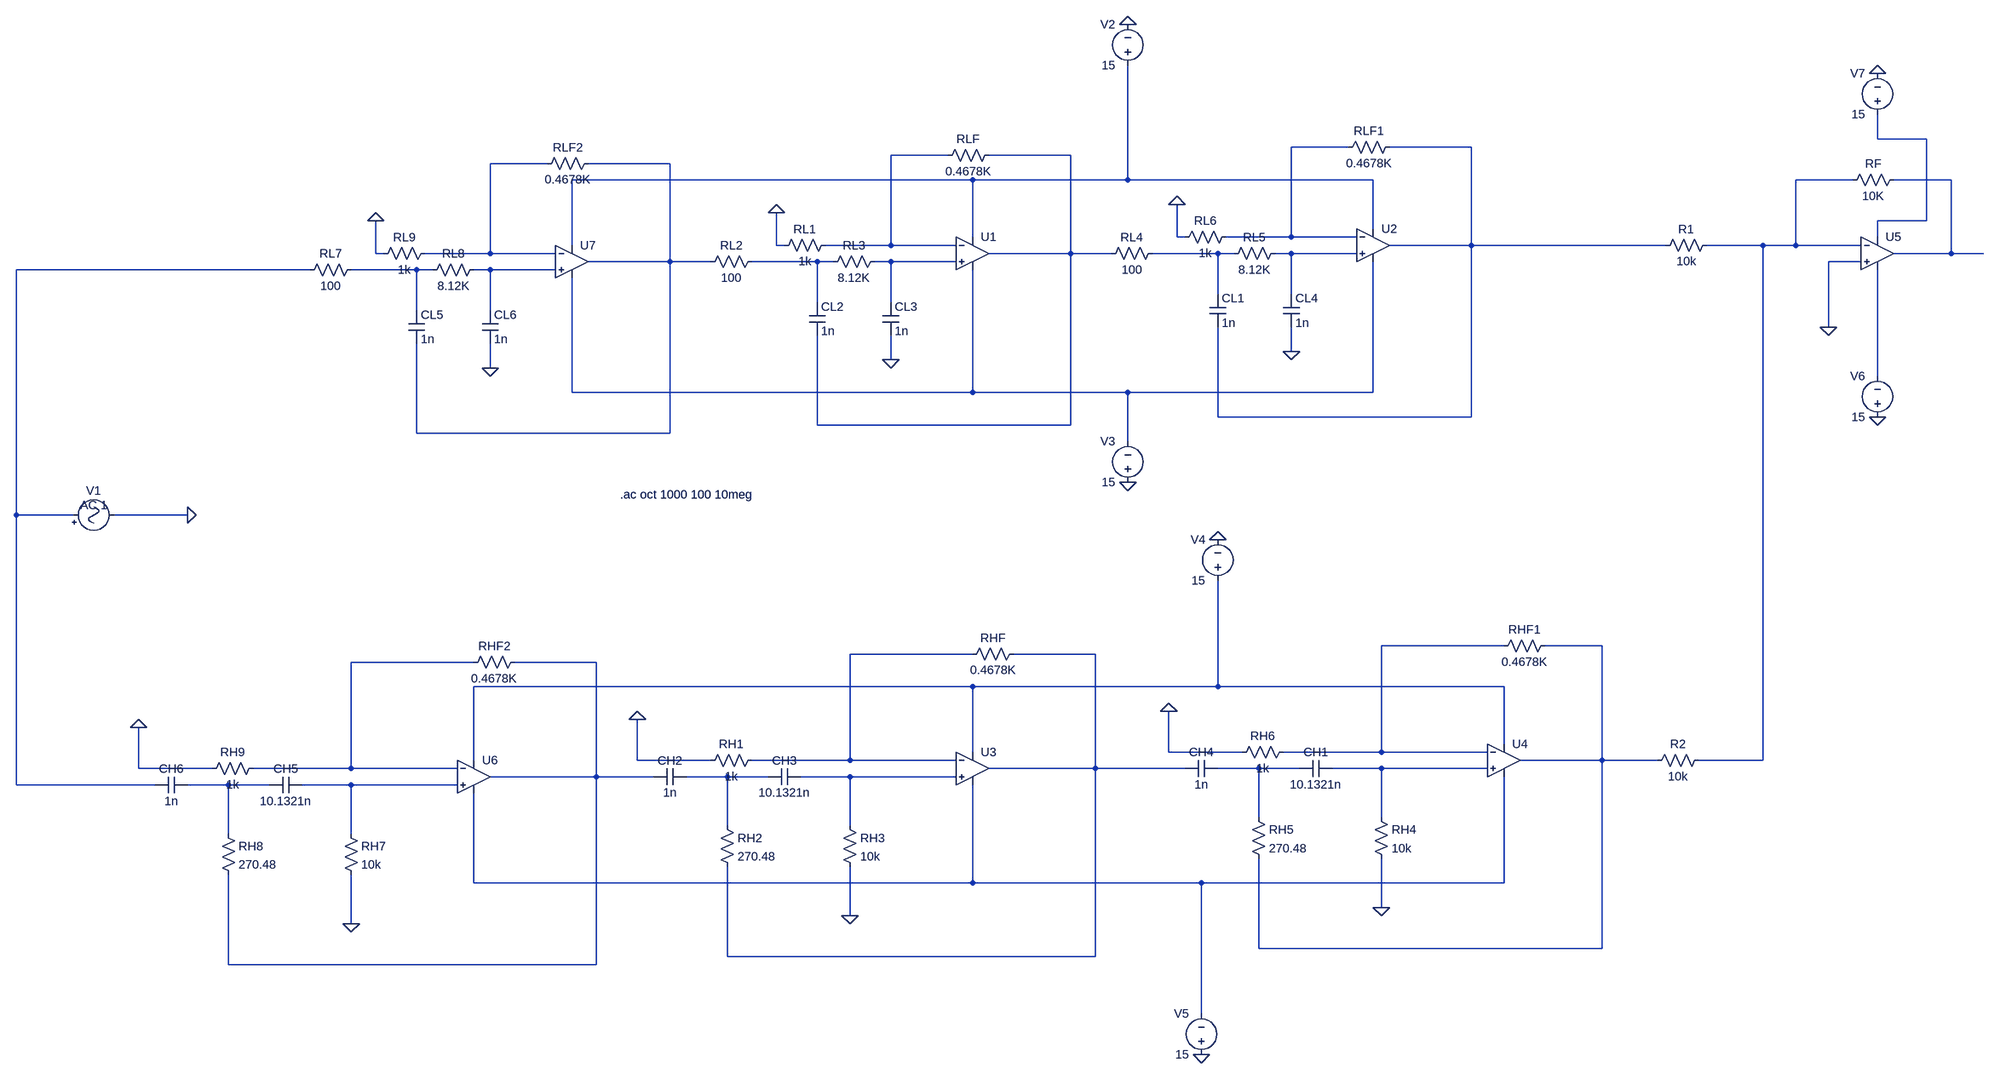
[diagram p0: schematic Band reject filter-schematic.asc]
Band reject filter-schematic.asc, the LTspice schematic file:
Version 4
SHEET 1 880 680
WIRE -1584 -2080 -1584 -2128
WIRE -1488 -2080 -1584 -2080
WIRE -2784 -2064 -2896 -2064
WIRE -2544 -2064 -2704 -2064
WIRE -3568 -2048 -3680 -2048
WIRE -3328 -2048 -3488 -2048
WIRE -4352 -2032 -4464 -2032
WIRE -4112 -2032 -4272 -2032
WIRE -3520 -2000 -4304 -2000
WIRE -3216 -2000 -3216 -2224
WIRE -3216 -2000 -3520 -2000
WIRE -2736 -2000 -3216 -2000
WIRE -1632 -2000 -1744 -2000
WIRE -1440 -2000 -1552 -2000
WIRE -1488 -1920 -1488 -2080
WIRE -1488 -1920 -1584 -1920
WIRE -2736 -1904 -2736 -2000
WIRE -3520 -1888 -3520 -2000
WIRE -3120 -1888 -3120 -1952
WIRE -3104 -1888 -3120 -1888
WIRE -2896 -1888 -2896 -2064
WIRE -2896 -1888 -3024 -1888
WIRE -2768 -1888 -2896 -1888
WIRE -1584 -1888 -1584 -1920
WIRE -4304 -1872 -4304 -2000
WIRE -3904 -1872 -3904 -1936
WIRE -3888 -1872 -3904 -1872
WIRE -3680 -1872 -3680 -2048
WIRE -3680 -1872 -3808 -1872
WIRE -3552 -1872 -3680 -1872
WIRE -2544 -1872 -2544 -2064
WIRE -2544 -1872 -2704 -1872
WIRE -2048 -1872 -2544 -1872
WIRE -1808 -1872 -1968 -1872
WIRE -1744 -1872 -1744 -2000
WIRE -1744 -1872 -1808 -1872
WIRE -1616 -1872 -1744 -1872
WIRE -4688 -1856 -4688 -1920
WIRE -4672 -1856 -4688 -1856
WIRE -4464 -1856 -4464 -2032
WIRE -4464 -1856 -4592 -1856
WIRE -4336 -1856 -4464 -1856
WIRE -3328 -1856 -3328 -2048
WIRE -3328 -1856 -3488 -1856
WIRE -3248 -1856 -3328 -1856
WIRE -3040 -1856 -3168 -1856
WIRE -3008 -1856 -3040 -1856
WIRE -2896 -1856 -2928 -1856
WIRE -2768 -1856 -2896 -1856
WIRE -1440 -1856 -1440 -2000
WIRE -1440 -1856 -1552 -1856
WIRE -1376 -1856 -1440 -1856
WIRE -4112 -1840 -4112 -2032
WIRE -4112 -1840 -4272 -1840
WIRE -4032 -1840 -4112 -1840
WIRE -3824 -1840 -3952 -1840
WIRE -3792 -1840 -3824 -1840
WIRE -3680 -1840 -3712 -1840
WIRE -3552 -1840 -3680 -1840
WIRE -1616 -1840 -1680 -1840
WIRE -4816 -1824 -5408 -1824
WIRE -4608 -1824 -4736 -1824
WIRE -4576 -1824 -4608 -1824
WIRE -4464 -1824 -4496 -1824
WIRE -4336 -1824 -4464 -1824
WIRE -3040 -1776 -3040 -1856
WIRE -2896 -1776 -2896 -1856
WIRE -3824 -1760 -3824 -1840
WIRE -3680 -1760 -3680 -1840
WIRE -4608 -1744 -4608 -1824
WIRE -4464 -1744 -4464 -1824
WIRE -1680 -1712 -1680 -1840
WIRE -2896 -1664 -2896 -1712
WIRE -3680 -1648 -3680 -1696
WIRE -4464 -1632 -4464 -1680
WIRE -1584 -1616 -1584 -1824
WIRE -4304 -1584 -4304 -1808
WIRE -3520 -1584 -3520 -1824
WIRE -3520 -1584 -4304 -1584
WIRE -3216 -1584 -3520 -1584
WIRE -2736 -1584 -2736 -1840
WIRE -2736 -1584 -3216 -1584
WIRE -3040 -1536 -3040 -1712
WIRE -2544 -1536 -2544 -1872
WIRE -2544 -1536 -3040 -1536
WIRE -3824 -1520 -3824 -1696
WIRE -3328 -1520 -3328 -1856
WIRE -3328 -1520 -3824 -1520
WIRE -4608 -1504 -4608 -1680
WIRE -4112 -1504 -4112 -1840
WIRE -4112 -1504 -4608 -1504
WIRE -3216 -1488 -3216 -1584
WIRE -5408 -1344 -5408 -1824
WIRE -5280 -1344 -5408 -1344
WIRE -5056 -1344 -5200 -1344
WIRE -2480 -1088 -2720 -1088
WIRE -2240 -1088 -2400 -1088
WIRE -3520 -1072 -3760 -1072
WIRE -3280 -1072 -3440 -1072
WIRE -4496 -1056 -4736 -1056
WIRE -4256 -1056 -4416 -1056
WIRE -3520 -1008 -4496 -1008
WIRE -3040 -1008 -3040 -1216
WIRE -3040 -1008 -3520 -1008
WIRE -2480 -1008 -3040 -1008
WIRE -2480 -896 -2480 -1008
WIRE -3520 -880 -3520 -1008
WIRE -3136 -880 -3136 -960
WIRE -2992 -880 -3136 -880
WIRE -2720 -880 -2720 -1088
WIRE -2720 -880 -2912 -880
WIRE -2512 -880 -2720 -880
WIRE -4496 -864 -4496 -1008
WIRE -4176 -864 -4176 -944
WIRE -4032 -864 -4176 -864
WIRE -3760 -864 -3760 -1072
WIRE -3760 -864 -3952 -864
WIRE -3552 -864 -3760 -864
WIRE -2240 -864 -2240 -1088
WIRE -2240 -864 -2448 -864
WIRE -2064 -864 -2240 -864
WIRE -1808 -864 -1808 -1872
WIRE -1808 -864 -1984 -864
WIRE -5152 -848 -5152 -928
WIRE -5008 -848 -5152 -848
WIRE -4736 -848 -4736 -1056
WIRE -4736 -848 -4928 -848
WIRE -4528 -848 -4736 -848
WIRE -3280 -848 -3280 -1072
WIRE -3280 -848 -3488 -848
WIRE -3104 -848 -3280 -848
WIRE -2960 -848 -3040 -848
WIRE -2880 -848 -2960 -848
WIRE -2720 -848 -2816 -848
WIRE -2512 -848 -2720 -848
WIRE -4256 -832 -4256 -1056
WIRE -4256 -832 -4464 -832
WIRE -4144 -832 -4256 -832
WIRE -4000 -832 -4080 -832
WIRE -3920 -832 -4000 -832
WIRE -3760 -832 -3856 -832
WIRE -3552 -832 -3760 -832
WIRE -5408 -816 -5408 -1344
WIRE -5120 -816 -5408 -816
WIRE -4976 -816 -5056 -816
WIRE -4896 -816 -4976 -816
WIRE -4736 -816 -4832 -816
WIRE -4528 -816 -4736 -816
WIRE -2960 -752 -2960 -848
WIRE -2720 -752 -2720 -848
WIRE -4000 -736 -4000 -832
WIRE -3760 -736 -3760 -832
WIRE -4976 -720 -4976 -816
WIRE -4736 -720 -4736 -816
WIRE -4496 -624 -4496 -800
WIRE -3520 -624 -3520 -816
WIRE -3520 -624 -4496 -624
WIRE -3072 -624 -3520 -624
WIRE -2480 -624 -2480 -832
WIRE -2480 -624 -3072 -624
WIRE -2720 -576 -2720 -672
WIRE -3760 -560 -3760 -656
WIRE -4736 -544 -4736 -640
WIRE -2960 -496 -2960 -672
WIRE -2240 -496 -2240 -864
WIRE -2240 -496 -2960 -496
WIRE -4000 -480 -4000 -656
WIRE -3280 -480 -3280 -848
WIRE -3280 -480 -4000 -480
WIRE -4976 -464 -4976 -640
WIRE -4256 -464 -4256 -832
WIRE -4256 -464 -4976 -464
WIRE -3072 -368 -3072 -624
FLAG -3904 -1936 0
FLAG -3680 -1648 0
FLAG -3120 -1952 0
FLAG -2896 -1664 0
FLAG -3216 -2304 0
FLAG -3216 -1408 0
FLAG -3760 -560 0
FLAG -4176 -944 0
FLAG -2720 -576 0
FLAG -3136 -960 0
FLAG -3040 -1296 0
FLAG -3072 -288 0
FLAG -1680 -1712 0
FLAG -1584 -1536 0
FLAG -1584 -2208 0
FLAG -4736 -544 0
FLAG -5152 -928 0
FLAG -4688 -1920 0
FLAG -4464 -1632 0
FLAG -5056 -1344 0
SYMBOL OpAmps\\UniversalOpAmp2 -3520 -1856 R0
SYMATTR InstName U1
SYMATTR Value2 Avol=1Meg GBW=100G Slew=10Meg
SYMBOL cap -3840 -1760 R0
SYMATTR InstName CL2
SYMATTR Value 1n
SYMBOL cap -3696 -1760 R0
SYMATTR InstName CL3
SYMATTR Value 1n
SYMBOL res -3936 -1856 R90
WINDOW 0 0 56 VBottom 2
WINDOW 3 32 56 VTop 2
SYMATTR InstName RL2
SYMATTR Value 100
SYMBOL res -3696 -1856 R90
WINDOW 0 0 56 VBottom 2
WINDOW 3 32 56 VTop 2
SYMATTR InstName RL3
SYMATTR Value 8.12K
SYMBOL res -3792 -1888 R90
WINDOW 0 0 56 VBottom 2
WINDOW 3 32 56 VTop 2
SYMATTR InstName RL1
SYMATTR Value 1k
SYMBOL res -3472 -2064 R90
WINDOW 0 0 56 VBottom 2
WINDOW 3 32 56 VTop 2
SYMATTR InstName RLF
SYMATTR Value 0.4678K
SYMBOL OpAmps\\UniversalOpAmp2 -2736 -1872 R0
SYMATTR InstName U2
SYMATTR Value2 Avol=1Meg GBW=100G Slew=10Meg
SYMBOL cap -3056 -1776 R0
SYMATTR InstName CL1
SYMATTR Value 1n
SYMBOL cap -2912 -1776 R0
SYMATTR InstName CL4
SYMATTR Value 1n
SYMBOL res -3152 -1872 R90
WINDOW 0 0 56 VBottom 2
WINDOW 3 32 56 VTop 2
SYMATTR InstName RL4
SYMATTR Value 100
SYMBOL res -2912 -1872 R90
WINDOW 0 0 56 VBottom 2
WINDOW 3 32 56 VTop 2
SYMATTR InstName RL5
SYMATTR Value 8.12K
SYMBOL res -3008 -1904 R90
WINDOW 0 0 56 VBottom 2
WINDOW 3 32 56 VTop 2
SYMATTR InstName RL6
SYMATTR Value 1k
SYMBOL res -2688 -2080 R90
WINDOW 0 0 56 VBottom 2
WINDOW 3 32 56 VTop 2
SYMATTR InstName RLF1
SYMATTR Value 0.4678K
SYMBOL voltage -3216 -2208 R180
WINDOW 0 24 96 Left 2
WINDOW 3 24 16 Left 2
WINDOW 123 0 0 Left 0
WINDOW 39 0 0 Left 0
SYMATTR InstName V2
SYMATTR Value 15
SYMBOL voltage -3216 -1392 R180
WINDOW 0 24 96 Left 2
WINDOW 3 24 16 Left 2
WINDOW 123 0 0 Left 0
WINDOW 39 0 0 Left 0
SYMATTR InstName V3
SYMATTR Value 15
SYMBOL OpAmps\\UniversalOpAmp2 -3520 -848 R0
SYMATTR InstName U3
SYMATTR Value2 Avol=1Meg GBW=100G Slew=10Meg
SYMBOL res -3424 -1088 R90
WINDOW 0 0 56 VBottom 2
WINDOW 3 32 56 VTop 2
SYMATTR InstName RHF
SYMATTR Value 0.4678K
SYMBOL cap -3856 -848 R90
WINDOW 0 0 32 VBottom 2
WINDOW 3 32 32 VTop 2
SYMATTR InstName CH3
SYMATTR Value 10.1321n
SYMBOL cap -4080 -848 R90
WINDOW 0 0 32 VBottom 2
WINDOW 3 32 32 VTop 2
SYMATTR InstName CH2
SYMATTR Value 1n
SYMBOL res -3776 -752 R0
SYMATTR InstName RH3
SYMATTR Value 10k
SYMBOL res -4016 -752 R0
SYMATTR InstName RH2
SYMATTR Value 270.48
SYMBOL res -3936 -880 R90
WINDOW 0 0 56 VBottom 2
WINDOW 3 32 56 VTop 2
SYMATTR InstName RH1
SYMATTR Value 1k
SYMBOL OpAmps\\UniversalOpAmp2 -2480 -864 R0
SYMATTR InstName U4
SYMATTR Value2 Avol=1Meg GBW=100G Slew=10Meg
SYMBOL res -2384 -1104 R90
WINDOW 0 0 56 VBottom 2
WINDOW 3 32 56 VTop 2
SYMATTR InstName RHF1
SYMATTR Value 0.4678K
SYMBOL cap -2816 -864 R90
WINDOW 0 0 32 VBottom 2
WINDOW 3 32 32 VTop 2
SYMATTR InstName CH1
SYMATTR Value 10.1321n
SYMBOL cap -3040 -864 R90
WINDOW 0 0 32 VBottom 2
WINDOW 3 32 32 VTop 2
SYMATTR InstName CH4
SYMATTR Value 1n
SYMBOL res -2736 -768 R0
SYMATTR InstName RH4
SYMATTR Value 10k
SYMBOL res -2976 -768 R0
SYMATTR InstName RH5
SYMATTR Value 270.48
SYMBOL res -2896 -896 R90
WINDOW 0 0 56 VBottom 2
WINDOW 3 32 56 VTop 2
SYMATTR InstName RH6
SYMATTR Value 1k
SYMBOL voltage -3040 -1200 R180
WINDOW 0 24 96 Left 2
WINDOW 3 24 16 Left 2
WINDOW 123 0 0 Left 0
WINDOW 39 0 0 Left 0
SYMATTR InstName V4
SYMATTR Value 15
SYMBOL voltage -3072 -272 R180
WINDOW 0 24 96 Left 2
WINDOW 3 24 16 Left 2
WINDOW 123 0 0 Left 0
WINDOW 39 0 0 Left 0
SYMATTR InstName V5
SYMATTR Value 15
SYMBOL res -1952 -1888 R90
WINDOW 0 0 56 VBottom 2
WINDOW 3 32 56 VTop 2
SYMATTR InstName R1
SYMATTR Value 10k
SYMBOL res -1968 -880 R90
WINDOW 0 0 56 VBottom 2
WINDOW 3 32 56 VTop 2
SYMATTR InstName R2
SYMATTR Value 10k
SYMBOL OpAmps\\UniversalOpAmp2 -1584 -1856 R0
SYMATTR InstName U5
SYMATTR Value2 Avol=1Meg GBW=100G Slew=10Meg
SYMBOL res -1536 -2016 R90
WINDOW 0 0 56 VBottom 2
WINDOW 3 32 56 VTop 2
SYMATTR InstName RF
SYMATTR Value 10K
SYMBOL voltage -1584 -1520 R180
WINDOW 0 24 96 Left 2
WINDOW 3 24 16 Left 2
WINDOW 123 0 0 Left 0
WINDOW 39 0 0 Left 0
SYMATTR InstName V6
SYMATTR Value 15
SYMBOL voltage -1584 -2112 R180
WINDOW 0 24 96 Left 2
WINDOW 3 24 16 Left 2
WINDOW 123 0 0 Left 0
WINDOW 39 0 0 Left 0
SYMATTR InstName V7
SYMATTR Value 15
SYMBOL OpAmps\\UniversalOpAmp2 -4496 -832 R0
SYMATTR InstName U6
SYMATTR Value2 Avol=1Meg GBW=100G Slew=10Meg
SYMBOL res -4400 -1072 R90
WINDOW 0 0 56 VBottom 2
WINDOW 3 32 56 VTop 2
SYMATTR InstName RHF2
SYMATTR Value 0.4678K
SYMBOL cap -4832 -832 R90
WINDOW 0 0 32 VBottom 2
WINDOW 3 32 32 VTop 2
SYMATTR InstName CH5
SYMATTR Value 10.1321n
SYMBOL cap -5056 -832 R90
WINDOW 0 0 32 VBottom 2
WINDOW 3 32 32 VTop 2
SYMATTR InstName CH6
SYMATTR Value 1n
SYMBOL res -4752 -736 R0
SYMATTR InstName RH7
SYMATTR Value 10k
SYMBOL res -4992 -736 R0
SYMATTR InstName RH8
SYMATTR Value 270.48
SYMBOL res -4912 -864 R90
WINDOW 0 0 56 VBottom 2
WINDOW 3 32 56 VTop 2
SYMATTR InstName RH9
SYMATTR Value 1k
SYMBOL OpAmps\\UniversalOpAmp2 -4304 -1840 R0
SYMATTR InstName U7
SYMATTR Value2 Avol=1Meg GBW=100G Slew=10Meg
SYMBOL cap -4624 -1744 R0
SYMATTR InstName CL5
SYMATTR Value 1n
SYMBOL cap -4480 -1744 R0
SYMATTR InstName CL6
SYMATTR Value 1n
SYMBOL res -4720 -1840 R90
WINDOW 0 0 56 VBottom 2
WINDOW 3 32 56 VTop 2
SYMATTR InstName RL7
SYMATTR Value 100
SYMBOL res -4480 -1840 R90
WINDOW 0 0 56 VBottom 2
WINDOW 3 32 56 VTop 2
SYMATTR InstName RL8
SYMATTR Value 8.12K
SYMBOL res -4576 -1872 R90
WINDOW 0 0 56 VBottom 2
WINDOW 3 32 56 VTop 2
SYMATTR InstName RL9
SYMATTR Value 1k
SYMBOL res -4256 -2048 R90
WINDOW 0 0 56 VBottom 2
WINDOW 3 32 56 VTop 2
SYMATTR InstName RLF2
SYMATTR Value 0.4678K
SYMBOL Misc\\signal -5296 -1344 R270
WINDOW 0 32 56 VTop 2
WINDOW 3 -32 56 VBottom 2
WINDOW 123 4 56 VTop 2
WINDOW 39 0 0 Left 0
SYMATTR InstName V1
SYMATTR Value ""
SYMATTR Value2 AC 1
TEXT -4210 -1384 Left 2 !.ac oct 1000 100 10meg

The netlist it stands for:
* Band reject filter-schematic.asc
XU1 N014 N004 N008 N019 N005 level2 Avol=1Meg GBW=100G Slew=10Meg Ilimit=25m Rail=0 Vos=0 En=0 Enk=0 In=0 Ink=0 Rin=500Meg  ; pins In+ In- V+ V- OUT
CL2 N013 N005 1n
CL3 N014 0 1n
RL2 N013 N007 100
RL3 N014 N013 8.12K
RL1 N004 0 1k
RLF N005 N004 0.4678K
XU2 N012 N002 N008 N019 N003 level2 Avol=1Meg GBW=100G Slew=10Meg Ilimit=25m Rail=0 Vos=0 En=0 Enk=0 In=0 Ink=0 Rin=500Meg  ; pins In+ In- V+ V- OUT
CL1 N011 N003 1n
CL4 N012 0 1n
RL4 N011 N005 100
RL5 N012 N011 8.12K
RL6 N002 0 1k
RLF1 N003 N002 0.4678K
V2 N008 0 15
V3 0 N019 15
XU3 N030 N022 N026 N033 N023 level2 Avol=1Meg GBW=100G Slew=10Meg Ilimit=25m Rail=0 Vos=0 En=0 Enk=0 In=0 Ink=0 Rin=500Meg  ; pins In+ In- V+ V- OUT
RHF N023 N022 0.4678K
CH3 N030 N029 10.1321n
CH2 N029 N025 1n
RH3 N030 0 10k
RH2 N029 N023 270.48
RH1 N022 0 1k
XU4 N028 N020 N026 N033 N021 level2 Avol=1Meg GBW=100G Slew=10Meg Ilimit=25m Rail=0 Vos=0 En=0 Enk=0 In=0 Ink=0 Rin=500Meg  ; pins In+ In- V+ V- OUT
RHF1 N021 N020 0.4678K
CH1 N028 N027 10.1321n
CH4 N027 N023 1n
RH4 N028 0 10k
RH5 N027 N021 270.48
RH6 N020 0 1k
V4 N026 0 15
V5 0 N033 15
R1 N009 N003 10k
R2 N009 N021 10k
XU5 0 N009 N001 N018 N010 level2 Avol=1Meg GBW=100G Slew=10Meg Ilimit=25m Rail=0 Vos=0 En=0 Enk=0 In=0 Ink=0 Rin=500Meg  ; pins In+ In- V+ V- OUT
RF N010 N009 10K
V6 0 N018 15
V7 N001 0 15
XU6 N032 N024 N026 N033 N025 level2 Avol=1Meg GBW=100G Slew=10Meg Ilimit=25m Rail=0 Vos=0 En=0 Enk=0 In=0 Ink=0 Rin=500Meg  ; pins In+ In- V+ V- OUT
RHF2 N025 N024 0.4678K
CH5 N032 N031 10.1321n
CH6 N031 N015 1n
RH7 N032 0 10k
RH8 N031 N025 270.48
RH9 N024 0 1k
XU7 N017 N006 N008 N019 N007 level2 Avol=1Meg GBW=100G Slew=10Meg Ilimit=25m Rail=0 Vos=0 En=0 Enk=0 In=0 Ink=0 Rin=500Meg  ; pins In+ In- V+ V- OUT
CL5 N016 N007 1n
CL6 N017 0 1n
RL7 N016 N015 100
RL8 N017 N016 8.12K
RL9 N006 0 1k
RLF2 N007 N006 0.4678K
V1 N015 0 AC 1
.ac oct 1000 100 10meg
.lib UniversalOpAmp2.lib
.backanno
.end